# EasyEDA Pro project ProPrj_USBC Hub_2025-04-12.epro

# Schematic Schematic1
Board Name: Board1; Create Date: 2025-04-10; Page Name: P1; Project Name: USBC Hub; Schematic Name: Schematic1; Update Date: 2025-04-12; Company: EasyEDA.com; Page Size: A4; Version: V1.0
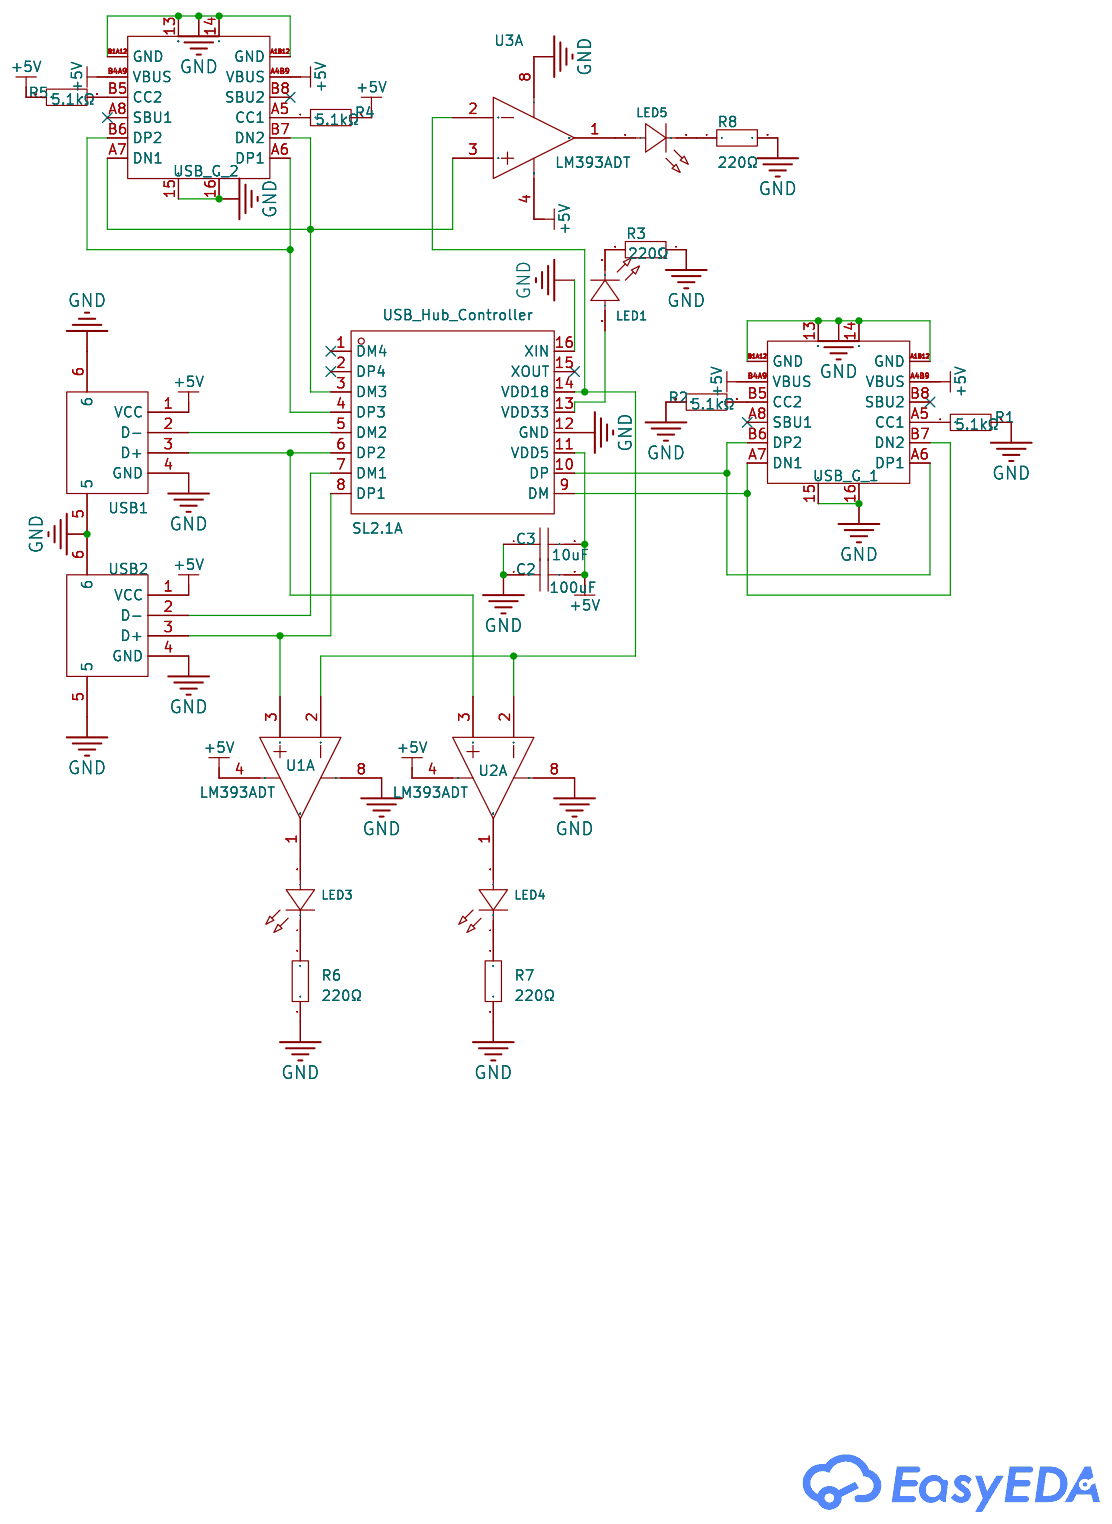
[diagram p0: schematic sheet]

## Parts
C2  100uF  [C1206]
C3  10uF  [C0603]
LED1  XL-1608UWC-04  [LED0603-RD_WHITE]
LED3  XL-1608UWC-04  [LED0603-RD_WHITE]
LED4  XL-1608UWC-04  [LED0603-RD_WHITE]
LED5  XL-1608UWC-04  [LED0603-RD_WHITE]
R1  5.1kΩ  [R0603]
R2  5.1kΩ  [R0603]
R3  220Ω  [R0603]
R4  5.1kΩ  [R0603]
R5  5.1kΩ  [R0603]
R6  220Ω  [R0603]
R7  220Ω  [R0603]
R8  220Ω  [R0603]
U1  LM393ADT  [SOIC-8_L4.9-W3.9-P1.27-LS6.0-BL]  (section 1)
U2  LM393ADT  [SOIC-8_L4.9-W3.9-P1.27-LS6.0-BL]  (section 1)
U3  LM393ADT  [SOIC-8_L4.9-W3.9-P1.27-LS6.0-BL]  (section 1)
USB1  903-131A1011D10100  [USB-A-TH_C46407]
USB2  903-131A1011D10100  [USB-A-TH_C46407]
USB_C_1  HYCW412-USBC16-065B  [USB-C-SMD_HYCW412-USBC16-065B]
USB_C_2  HYCW412-USBC16-065B  [USB-C-SMD_HYCW412-USBC16-065B]
USB_Hub_Controller  SL2.1A  [SOP-16_L10.0-W3.9-P1.27-LS6.0-BL]

## Library data of the parts
C2 = CL31A107MQHNNNE: Capacitance: Tolerance:±20% Tolerance:±20% Voltage Rated: Temperature Coefficient:; LCSC Part Name: 100uF ±20% 6.3V; Supplier Part: C15008; Manufacturer: SAMSUNG(三星); Supplier Footprint: 1206; JLCPCB Part Class: Basic Part; Datasheet: https://atta.szlcsc.com/upload/public/pdf/source/20160218/1457707763339.pdf; Supplier: LCSC; Tolerance: ±20%; Check: false
C3 = CL10A106KP8NNNC: Capacitance: Tolerance:±10% Tolerance:±10% Voltage Rated: Temperature Coefficient:; LCSC Part Name: 10uF ±10% 10V; Supplier Part: C19702; Manufacturer: SAMSUNG(三星); Supplier Footprint: 0603; JLCPCB Part Class: Basic Part; Datasheet: https://atta.szlcsc.com/upload/public/pdf/source/20160218/1457707763339.pdf; Supplier: LCSC; Tolerance: ±10%; Check: false
LED1 LED3-LED5 = XL-1608UWC-04: Emitted Color:White Power Dissipation:80mW Forward Current:25mA Dominant Wavelength:- Dominant Wavelength:- Lens Color:黄色透镜 Color Temperature:13700K~19000K Color Temperature:13700K~19000K Viewing Angle:120° Mounting Sytle:Positive post Operating Temperatu; Supplier Part: C965808; Manufacturer: XINGLIGHT(成兴光); Supplier Footprint: 0603; Datasheet: https://atta.szlcsc.com/upload/public/pdf/source/20221102/585FFDAF9A16AAB1CA7BDF9640D81A72.pdf; Supplier: LCSC; Emitted Color: White; Power Dissipation: 80mW; Forward Current: 25mA; Lens Color: 黄色透镜; Color Temperature: 13700K~19000K; Viewing Angle: 120°; Mounting Sytle: Positive post; Operating Temperature: -30℃~+85℃; Check: false
R1 R2 R4 R5 = HoAR0603-1/10W-5.1KR-0.1%-TCR25: Type:Ceramic resistor Resistance: Tolerance:±0.1% Tolerance:±0.1% Power(Watts): Temperature Coefficient:±25ppm/℃ Temperature Coefficient:±25ppm/℃; LCSC Part Name: 陶瓷电阻 5.1kΩ ±0.1% 100mW; Supplier Part: C5123587; Manufacturer: Milliohm(毫欧); Supplier Footprint: 0603; JLCPCB Part Class: Extended Part; Datasheet: https://atta.szlcsc.com/upload/public/pdf/source/20220805/A2159937FBAFAA41BC9FCEA1EE3FFB75.pdf; Supplier: LCSC; Type: Ceramic resistor; Tolerance: ±0.1%; Temperature Coefficient: ±25ppm/℃; Check: false
R3 R6-R8 = SCR0603J220R: Type:Thick Film Resistors Resistance: Tolerance:±5% Tolerance:±5% Power(Watts): Overload Voltage (Max): Operating Temperature Range:-55℃~+155℃ Operating Temperature Range:-55℃~+155℃; LCSC Part Name: 厚膜电阻 220Ω ±5% 100mW; Supplier Part: C3017752; Manufacturer: VO(翔胜); Supplier Footprint: 0603; JLCPCB Part Class: Extended Part; Datasheet: https://atta.szlcsc.com/upload/public/pdf/source/20220513/247AF9639BA21CF93567DC289CCC6A22.pdf; Supplier: LCSC; Type: Thick Film Resistors; Tolerance: ±5%; Operating Temperature Range: -55℃~+155℃; Check: false
U1-U3 = LM393ADT: Input Offset Voltage (Vos):2mV Input Bias Current (Ib):100nA Input Hysteresis Voltage (Vhys):- Common Mode Rejection Ratio (CMRR):- Supply Voltage:1V~18V；2V~36V Supply Voltage:1V~18V；2V~36V Output Type:开集 Output Mode:- Supply Current:2.5mA Operating Tempe; Supplier Part: C136033; Manufacturer: ST(意法半导体); Supplier Footprint: SOIC-8; JLCPCB Part Class: Extended Part; Datasheet: https://atta.szlcsc.com/upload/public/pdf/source/20181012/C143242_3AD034BD1940D1077F50B89F8FC82246.pdf; Supplier: LCSC; Input Offset Voltage (Vos): 2mV; Input Bias Current (Ib): 100nA; Supply Voltage: 1V~18V；2V~36V; Output Type: 开集; Supply Current: 2.5mA; Operating Temperature: 0℃~+70℃; Check: false
USB1 USB2 = 903-131A1011D10100: Connector Type:Type-A Standard:USB 2.0 Gender:Female Number of Ports:1 Number of Contacts:4P Current Rating - Power (Max):1.5A; LCSC Part Name: Type-A 母; Supplier Part: C46407; Manufacturer: 精拓金; Supplier Footprint: 插件; JLCPCB Part Class: Extended Part; Datasheet: https://atta.szlcsc.com/upload/public/pdf/source/20210301/C46407_0FDCFD777E72B2503A3E09AE32E4643C.pdf; Supplier: LCSC; Connector Type: Type-A; Standard: USB 2.0; Gender: Female; Number of Ports: 1; Number of Contacts: 4P; Current Rating - Power (Max): 1.5A; Check: false
USB_C_1 USB_C_2 = HYCW412-USBC16-065B: Connector Type:Type-C Gender:Female Number of Contacts:16P; LCSC Part Name: 二件套 Type-C 母; Supplier Part: C5342196; Manufacturer: 华宇创; Supplier Footprint: SMD; JLCPCB Part Class: Extended Part; Datasheet: https://atta.szlcsc.com/upload/public/pdf/source/20230131/337A7783171315B9C5BDC3CFAC633E94.pdf; Supplier: LCSC; Connector Type: Type-C; Gender: Female; Number of Contacts: 16P; Check: false
USB_Hub_Controller = SL2.1A: LCSC Part Name: USB2.0高速4端口HUB控制器; Supplier Part: C192893; Manufacturer: CoreChips(和芯润德); Supplier Footprint: SOP-16; JLCPCB Part Class: Extended Part; Datasheet: https://atta.szlcsc.com/upload/public/pdf/source/20180522/C192893_624110D24898D57AAC785E3DF98EA862.pdf; Supplier: LCSC; Check: false

## Nets
+5V: C2.2 C3.2 R4.2 R5.1 U1.4(GND) U2.4(GND) U3.4(GND) USB1.1(VCC) USB2.1(VCC) USB_C_1.A4B9(VBUS) USB_C_1.B4A9(VBUS) USB_C_2.A4B9(VBUS) USB_C_2.B4A9(VBUS) USB_Hub_Controller.11(VDD5)
GND: C2.1 C3.1 R1.2 R2.1 R3.1 R6.2 R7.2 R8.2 U1.8(V+) U2.8(V+) U3.8(V+) USB1.4(GND) USB1.5 USB1.6 USB2.4(GND) USB2.5 USB2.6 USB_C_1.13 USB_C_1.14 USB_C_1.15 USB_C_1.16 USB_C_1.A1B12(GND) USB_C_1.B1A12(GND) USB_C_2.13 USB_C_2.14 USB_C_2.15 USB_C_2.16 USB_C_2.A1B12(GND) USB_C_2.B1A12(GND) USB_Hub_Controller.12(GND) USB_Hub_Controller.16(XIN)
$1N1366: R2.2 USB_C_1.B5(CC2)
$1N1536: R1.1 USB_C_1.A5(CC1)
$1N2819: USB_C_1.A6(DP1) USB_C_1.B6(DP2) USB_Hub_Controller.10(DP)
$1N2869: USB_C_1.A7(DN1) USB_C_1.B7(DN2) USB_Hub_Controller.9(DM)
$1N3533: LED1.2(A) USB_Hub_Controller.13(VDD33)
$1N3624: LED1.1(K) R3.2
$1N3984: USB1.2(D-) USB_Hub_Controller.5(DM2)
$1N3991: U2.3(IN+) USB1.3(D+) USB_Hub_Controller.6(DP2)
$1N3998: U1.3(IN+) USB2.3(D+) USB_Hub_Controller.8(DP1)
$1N4004: USB2.2(D-) USB_Hub_Controller.7(DM1)
$1N4089: USB_C_2.A6(DP1) USB_C_2.B6(DP2) USB_Hub_Controller.4(DP3)
$1N4094: U3.3(IN+) USB_C_2.A7(DN1) USB_C_2.B7(DN2) USB_Hub_Controller.3(DM3)
$1N4312: R4.1 USB_C_2.A5(CC1)
$1N4362: R5.2 USB_C_2.B5(CC2)
$1N4464: U1.2(IN-) U2.2(IN-) U3.2(IN-) USB_Hub_Controller.14(VDD18)
$1N5667: LED3.2(A) U1.1(OUT)
$1N5671: LED3.1(K) R6.1
$1N5762: LED4.1(K) R7.1
$1N5766: LED4.2(A) U2.1(OUT)
$1N5855: LED5.1(K) R8.1
$1N5859: LED5.2(A) U3.1(OUT)

Not connected (* = marked no-connect by the designer): USB_C_1 A8(SBU1)* B8(SBU2)*; USB_C_2 A8(SBU1)* B8(SBU2)*; USB_Hub_Controller 1(DM4)* 2(DP4)* 15(XOUT)*

# Board PCB1
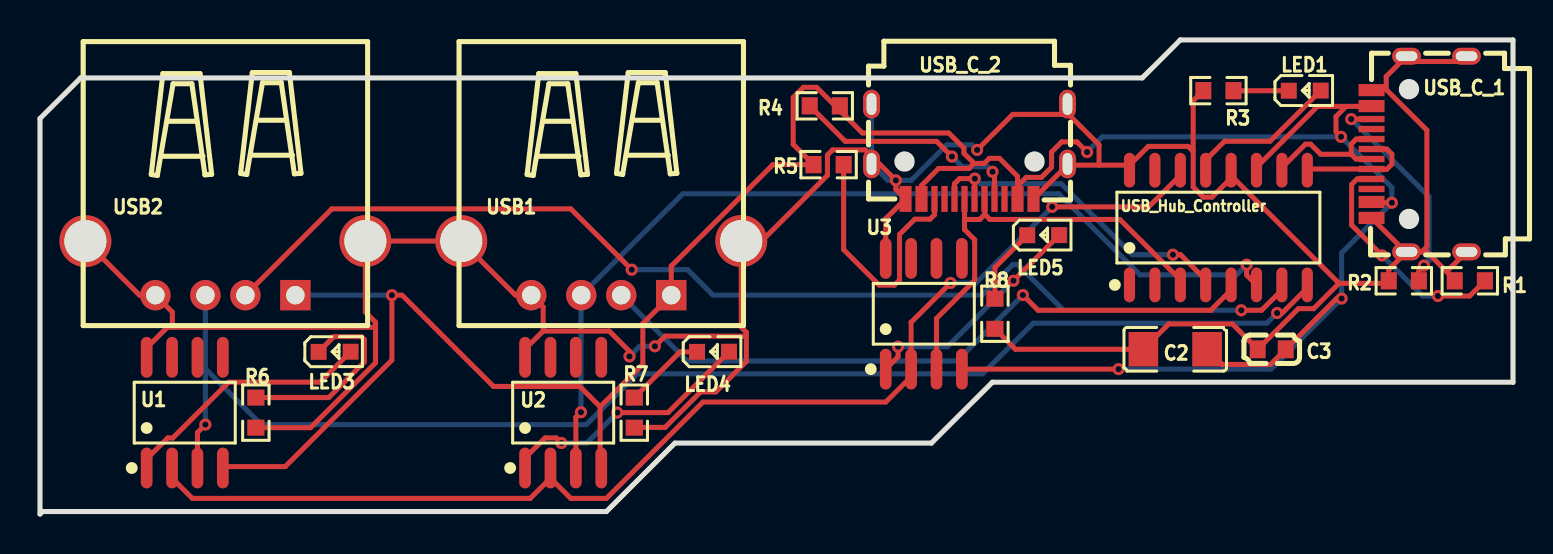
[diagram p1: board, top side]
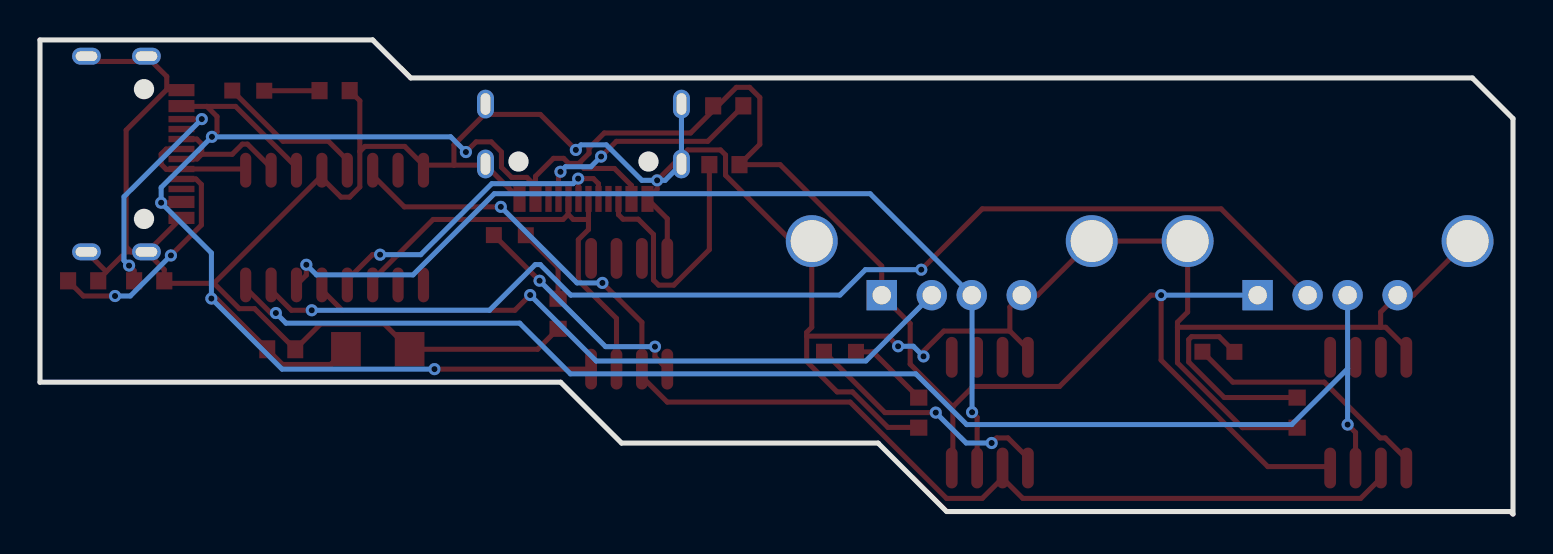
[diagram p2: board, bottom side, seen from below]

Outline 73.66 x 23.75 mm; copper layers: Top Layer, Bottom Layer. Coordinates in mm from the lower left corner of the outline.
Outline path: 0,19.81 2.03,21.84 55.12,21.84 57.02,23.75 73.66,23.75 73.66,6.6 47.63,6.6 44.58,3.56 31.75,3.56 28.32,0.13 0.13,0.13 0,0 0,19.81
Stack: Top Layer 0.035mm / Dielectric1 1.51mm FR4 er 4.5 / Bottom Layer 0.035mm

## Design rules (mm)
template: JLCPCB Capability(Two Layers Board)
spacing copperThickness1oz (default): track to track 0.102, other pairs 0.152 to 0.3
spacing copperThickness2oz: track to track 0.203, other pairs 0.152 to 0.3
track width copperThickness1oz (default): min 0.127, default 0.254, max 2.54
track width copperThickness2oz: min 0.203, default 0.254, max 2.54
differential pair differentialPair (default): width min 0.127, default 0.254, max 2.54; gap min 0.152, default 0.152
via viaSize (default): diameter min 0.5, default 0.61, max 10; hole min 0.3, default 0.305, max 6.3

## Placement (name value [footprint] x y rotation side)
C2  100uF  [C1206]  56.77 8.26 0 top
C3  10uF  [C0603]  61.6 8.26 0 top
LED1  XL-1608UWC-04  [LED0603-RD_WHITE]  63.25 21.21 0 top
LED3  XL-1608UWC-04  [LED0603-RD_WHITE]  14.73 8.13 0 top
LED4  XL-1608UWC-04  [LED0603-RD_WHITE]  33.66 8.13 0 top
LED5  XL-1608UWC-04  [LED0603-RD_WHITE]  50.17 13.97 0 top
R1  5.1kΩ  [R0603]  71.5 11.68 180 top
R2  5.1kΩ  [R0603]  68.2 11.68 0 top
R3  220Ω  [R0603]  58.93 21.21 0 top
R4  5.1kΩ  [R0603]  39.24 20.45 0 top
R5  5.1kΩ  [R0603]  39.43 17.5 0 top
R6  220Ω  [R0603]  10.8 5.08 270 top
R7  220Ω  [R0603]  29.72 5.08 270 top
R8  220Ω  [R0603]  47.75 10.03 270 top
U1  LM393ADT  [SOIC-8_L4.9-W3.9-P1.27-LS6.0-BL]  7.24 5.08 0 top
U2  LM393ADT  [SOIC-8_L4.9-W3.9-P1.27-LS6.0-BL]  26.16 5.08 0 top
U3  LM393ADT  [SOIC-8_L4.9-W3.9-P1.27-LS6.0-BL]  44.2 10.03 0 top
USB1  903-131A1011D10100  [USB-A-TH_C46407]  28.07 12.32 180 top
USB2  903-131A1011D10100  [USB-A-TH_C46407]  9.27 12.32 180 top
USB_C_1  HYCW412-USBC16-065B  [USB-C-SMD_HYCW412-USBC16-065B]  68.96 18.03 90 top
USB_C_2  HYCW412-USBC16-065B  [USB-C-SMD_HYCW412-USBC16-065B]  46.48 18.16 180 top
USB_Hub_Controller  SL2.1A  [SOP-16_L10.0-W3.9-P1.27-LS6.0-BL]  58.93 14.35 0 top

## Footprints (pads in the part's own frame, mm; a bottom-side part is the same pattern mirrored in y, then rotated)
C0603
  rect 0.8x0.9 smd: 1(-0.7,0) 2(0.7,0)
C1206
  rect 1.485x1.728 smd: 1(-1.593,0) 2(1.593,0)
LED0603-RD_WHITE
  rect 0.8x0.8 smd: 1(-0.799,-0.004) 2(0.799,0.004)
R0603
  rect 0.806x0.864 smd: 1(-0.753,0) 2(0.753,0)
SOIC-8_L4.9-W3.9-P1.27-LS6.0-BL
  oval 0.588x2.045 smd: 1(-1.905,-2.772) 2(-0.635,-2.772) 3(0.635,-2.772) 4(1.905,-2.772) 5(1.905,2.772) 6(0.635,2.772) 7(-0.635,2.772) 8(-1.905,2.772)
SOP-16_L10.0-W3.9-P1.27-LS6.0-BL
  oval 0.56x1.745 smd: 1(-4.445,-2.873) 2(-3.175,-2.873) 3(-1.905,-2.873) 4(-0.635,-2.873) 5(0.635,-2.873) 6(1.905,-2.873) 7(3.175,-2.873) 8(4.445,-2.873) 9(4.445,2.873) 10(3.175,2.873) 11(1.905,2.873) 12(0.635,2.873) 13(-0.635,2.873) 14(-1.905,2.873) 15(-3.175,2.873) 16(-4.445,2.873)
USB-A-TH_C46407
  rect 1.524x1.524 hole 0.92: 1(-3.5,1.355)
  round 1.524 hole 0.92: 2(-1,1.355) 3(1,1.355) 4(3.5,1.355)
  round 2.6 hole 2.1: 5(7,-1.355) 6(-7,-1.355)
USB-C-SMD_HYCW412-USBC16-065B
  oval 0.85x1.44 hole 0.48x1.08: 13(-4.9,0.625) 14(4.9,0.625) 15(-4.9,-2.375) 16(4.9,-2.375)
  rect 0.61x1.3 smd: A1B12(-3.2,2.375) A4B9(-2.4,2.375) B1A12(3.2,2.375) B4A9(2.4,2.375)
  rect 0.32x1.3 smd: A5(-1.25,2.375) A6(-0.25,2.375) A7(0.25,2.375) A8(1.25,2.375) B5(1.75,2.375) B6(0.75,2.375) B7(-0.75,2.375) B8(-1.75,2.375)

## Nets
As in the schematic.

Pads without a net: U1 5 6 7; U2 5 6 7; U3 5 6 7; USB_C_1 A8 B8; USB_C_2 A8 B8; USB_Hub_Controller 1 2 15

## Via types
v1: diameter 0.61, hole 0.305, Top Layer to Bottom Layer, 31 vias

## Routing (per net, layer and track width the routed paths; a pad name or vN(x,y) marks a point on that pad's centre or on a via; arc(x,y) is an arc through that point)
+5V: length 142
  Top Layer w0.254: USB_C_1.B4A9 66.57,20.42 65.32,20.42 ; 28.01,5.38 30.14,7.51 30.14,9.54 USB1.1 ; 28.01,5.38 28.01,2.36 U2.4 ; 28.01,5.38 26.99,6.39 22.68,6.39 18.11,10.96 v1(17.6,10.96) 17.6,7.71 12.26,2.38 9.22,2.38 U1.4 ; USB_C_2.B4A9 44.08,16.46 44.93,17.31 46.46,17.31 46.71,17.56 ; v1(52.36,18.13) 51.85,18.64 51.09,18.64 50.58,18.13 50.58,17.37 50.08,16.86 49.31,16.86 48.88,16.43 ; 39.85,20.36 38.84,21.37 38.17,21.37 37.67,20.87 37.67,18.52 R5.1 36.65,17.5 31.57,12.42 31.57,10.97 ; 39.85,20.36 41.12,19.09 45.44,19.09 46.2,18.33 46.2,18.07 46.71,17.56 ; 39.85,20.36 39.91,20.36 R4.2 ; 48.88,16.43 48.88,16.92 47.98,17.82 47.47,17.82 47.22,17.56 46.71,17.56 ; 48.88,16.43 48.88,15.79 ; USB_C_1.A4B9 66.63,15.59 v1(67.6,15.59) ; 65.32,20.42 63.88,20.42 60.83,17.37 USB_Hub_Controller.11 ; 65.32,20.42 64.81,19.91 64.81,19.15 v1(65.06,18.9) ; v1(53.93,7.26) U3.4 ; v1(65.09,10.8) 64.83,10.8 C3.2 61.53,7.49 59.12,7.49 C2.2
  Bottom Layer w0.254: v1(52.36,18.13) 53.12,18.9 v1(65.06,18.9) 67.6,16.36 v1(67.6,15.59) 65.09,13.08 v1(65.09,10.8) 61.55,7.26 v1(53.93,7.26) ; v1(17.6,10.96) USB2.1
GND: length 175.4
  Top Layer w0.254: USB_C_1.B1A12 66.61,21.26 67.32,21.26 ; 67.32,21.26 67.32,21.92 USB_C_1.14 68.6,22.67 71.07,22.67 USB_C_1.16 ; 67.32,21.26 69.35,19.23 69.35,13.39 69.1,13.13 ; 51.43,17.48 51.38,17.54 ; 51.43,17.48 51.37,17.48 USB_C_2.A1B12 ; 51.43,17.48 52.96,17.48 ; 51.38,20.54 51.43,20.48 51.43,20.02 ; 70.37,12.12 70.75,11.74 R1.2 ; 70.37,12.12 69.35,13.13 69.1,13.13 ; 70.37,12.12 70.37,12.17 USB_C_1.15 ; USB_C_1.13 69.1,13.13 ; USB_C_1.13 67.45,12.24 R2.1 67.32,11.56 64.96,11.56 ; USB_C_1.13 68.29,13.13 USB_C_1.A1B12 ; USB_Hub_Controller.12 59.63,17.16 59.63,16.89 ; 57.67,18.16 57.67,16.38 58.17,15.88 58.61,15.88 59.63,16.89 ; 57.67,18.16 57.41,18.42 55.42,18.42 54.48,17.48 ; 57.67,18.16 57.67,20.7 R3.1 ; 59.63,16.89 64.96,11.56 ; 6.62,9.36 6.62,10.12 USB2.4 4.98,10.96 USB2.5 ; 6.62,9.36 6.36,9.36 5.35,8.34 5.35,7.87 U1.8 ; 6.62,9.36 16.78,9.36 ; 54.48,17.48 52.96,17.48 ; 54.48,17.48 USB_Hub_Controller.16 ; 52.96,17.48 52.96,18.49 51.43,20.02 ; 25.16,9.17 25.16,10.37 USB1.4 23.78,10.96 USB1.5 USB2.6 16.27,10.12 16.78,9.61 16.78,9.36 ; 25.16,9.17 24.26,8.26 U2.8 ; 25.16,9.17 28.46,9.17 29.48,8.15 v1(29.48,7.9) ; 64.96,11.56 63.69,10.29 62.93,10.29 C3.1 59.63,9.53 56.45,9.53 C2.1 48.78,8.26 R8.2 ; U3.8 42.29,14.8 43.28,15.79 42.8,16.27 v1(42.8,16.72) 41.27,18.24 39.63,18.24 39.38,17.99 39.38,16.97 36.08,13.67 USB1.6 35.07,9.36 35.32,9.1 35.32,8.91 ; 35.32,8.91 35.32,7.64 33.8,6.12 33.04,6.12 31.26,4.34 29.73,4.34 R7.2 ; 35.32,8.91 31.26,8.91 v1(30.75,8.41) ; v1(46.86,18.24) 48.64,20.02 51.43,20.02 ; R6.2 13.53,4.33 16.78,7.58 16.78,9.36
  Bottom Layer w0.254: v1(46.86,18.24) 46.61,18.49 45.34,18.49 43.56,16.72 v1(42.8,16.72) 42.4,16.72 USB_C_2.14 USB_C_2.16 ; v1(29.48,7.9) 29.99,8.41 v1(30.75,8.41)
$1N1366: length 10.9
  Top Layer w0.254: v1(69.21,12.45) 68.95,12.19 R2.2 ; v1(65.57,19.78) USB_C_1.B5
  Bottom Layer w0.254: v1(65.57,19.78) 69.46,15.89 69.46,12.7 v1(69.21,12.45)
$1N1536: length 11.6
  Top Layer w0.254: R1.1 71.49,10.92 v1(69.91,10.92) ; USB_C_1.A5 65.86,16.78 65.59,16.51 65.59,14.48 v1(67.11,12.95)
  Bottom Layer w0.254: v1(69.91,10.92) 69.15,10.92 v1(67.11,12.95)
$1N2819: length 7
  Top Layer w0.254: USB_C_1.A6 65.81,17.78 65.57,18.02 ; 65.57,18.02 65.57,18.53 65.82,18.78 USB_C_1.B6 ; 65.57,18.02 64.05,18.02 63.54,18.53 63.28,18.53 62.1,17.35 USB_Hub_Controller.10
$1N2869: length 6
  Top Layer w0.254: USB_Hub_Controller.9 63.43,17.28 USB_C_1.B7 66.6,17.27 67.35,17.27 67.6,17.52 67.6,18.03 67.35,18.28 USB_C_1.A7
$1N3533: length 7.7
  Top Layer w0.254: LED1.2 61.51,18.67 59.23,18.67 58.29,17.73 USB_Hub_Controller.13
$1N3624: length 2.8
  Top Layer w0.254: LED1.1 59.68,21.21
$1N3984: length 34.2
  Top Layer w0.254: v1(49.15,10.97) 49.91,10.21 58.55,10.21 59.56,11.22 USB_Hub_Controller.5
  Bottom Layer w0.254: USB1.2 32.36,7.67 45.85,7.67 v1(49.15,10.97)
$1N3991: length 47.3
  Top Layer w0.254: USB_Hub_Controller.6 60.34,11.97 v1(60.34,12.49) ; U2.3 26.8,4.85 v1(27.05,5.1)
  Bottom Layer w0.254: v1(27.05,5.1) 27.05,10.95 USB1.3 32.15,16.04 50.94,16.04 55.01,11.98 59.83,11.98 v1(60.34,12.49)
$1N3998: length 68.1
  Top Layer w0.254: 7.87,2.31 7.87,4.09 v1(8.27,4.48) ; USB_Hub_Controller.8 63.39,11.46 63.39,11.34 62.12,10.07 v1(61.86,10.07)
  Bottom Layer w0.254: 8.27,7.28 USB2.3 ; 8.27,7.28 v1(8.27,4.48) ; 8.27,7.28 11.06,4.48 27.32,4.48 29.86,7.02 47.13,7.02 49.67,9.56 61.36,9.56 v1(61.86,10.07)
$1N4004: length 57.7
  Top Layer w0.254: v1(29.59,12.24) 26.54,15.29 14.6,15.29 USB2.2 ; USB_Hub_Controller.7 62.1,11.22 61.09,10.21 v1(60.07,10.21)
  Bottom Layer w0.254: v1(60.07,10.21) 51.18,10.21 48.89,12.49 48.64,12.49 47.12,10.97 33.66,10.97 32.39,12.24 v1(29.59,12.24)
$1N4089: length 16.9
  Top Layer w0.254: 46.49,16.8 46.73,16.56 USB_C_2.A6 ; 46.49,16.8 v1(46.75,16.8) ; 46.49,16.8 45.99,16.8 45.73,16.55 USB_C_2.B6 ; v1(56.65,12.99) 57.03,12.99 58.19,11.84 58.19,11.59 USB_Hub_Controller.4
  Bottom Layer w0.254: v1(46.75,16.8) 47,16.55 51.07,16.55 54.62,12.99 v1(56.65,12.99)
$1N4094: length 22.8
  Top Layer w0.254: USB_Hub_Controller.3 57.02,11.73 54,14.76 47.5,14.76 47.25,15.01 ; 47.25,15.01 46.99,14.76 46.23,14.76 ; 47.25,15.01 47.25,15.77 USB_C_2.B7 ; 46.23,14.76 USB_C_2.A7 ; 46.23,14.76 46.23,14.25 46.74,13.74 46.74,11.71 44.83,9.8 U3.3
$1N4312: length 11.9
  Top Layer w0.254: v1(47.63,17.14) 47.73,17.05 USB_C_2.A5 ; v1(45.6,17.91) 44.84,18.67 40.27,18.67 R4.1
  Bottom Layer w0.254: v1(45.6,17.91) 46.11,17.4 47.38,17.4 v1(47.63,17.14)
$1N4362: length 13.1
  Top Layer w0.254: USB_C_2.B5 44.73,15 44.51,14.77 43.74,14.77 42.98,14.01 42.98,11.72 42.73,11.47 41.97,11.47 40.19,13.25 40.19,17.5
$1N4464: length 61.3
  Top Layer w0.254: 25.53,1.8 24.51,0.78 7.62,0.78 6.6,1.8 U1.2 ; 25.53,1.8 U2.2 ; 25.53,1.8 26.54,0.78 28.32,0.78 33.15,5.61 42.29,5.61 43.56,6.88 U3.2 43.56,9.6 v1(45.54,11.58) ; v1(50.62,15.39) 55.44,15.39 56.97,16.91 56.97,17.17 USB_Hub_Controller.14
  Bottom Layer w0.254: v1(50.62,15.39) 46.81,11.58 v1(45.54,11.58)
$1N5667: length 12.9
  Top Layer w0.254: U1.1 5.33,2.76 6.39,3.81 6.64,3.81 9.44,6.61 14.01,6.61 LED3.2
$1N5671: length 9.9
  Top Layer w0.254: 10.8,5.84 14.44,5.84 16.22,7.62 16.22,8.74 16.07,8.89 14.69,8.89 LED3.1
$1N5762: length 4.1
  Top Layer w0.254: LED4.1 32.01,8.12 R7.1
$1N5766: length 13.1
  Top Layer w0.254: LED4.2 31.41,5.08 v1(28.87,5.08) ; v1(26.07,3.56) 25.82,3.81 25.26,3.81 24.26,2.82 U2.1
  Bottom Layer w0.254: v1(28.87,5.08) 27.34,3.56 v1(26.07,3.56)
$1N5855: length 3.8
  Top Layer w0.254: LED5.1 47.75,12.35 R8.1
$1N5859: length 11.8
  Top Layer w0.254: v1(42.91,8.39) 42.91,7.88 U3.1 ; LED5.2 v1(48.68,11.69)
  Bottom Layer w0.254: v1(42.91,8.39) 45.38,8.39 v1(48.68,11.69)
